# EAGLE design dawa_v2.1 (EAGLE 7.4.0)
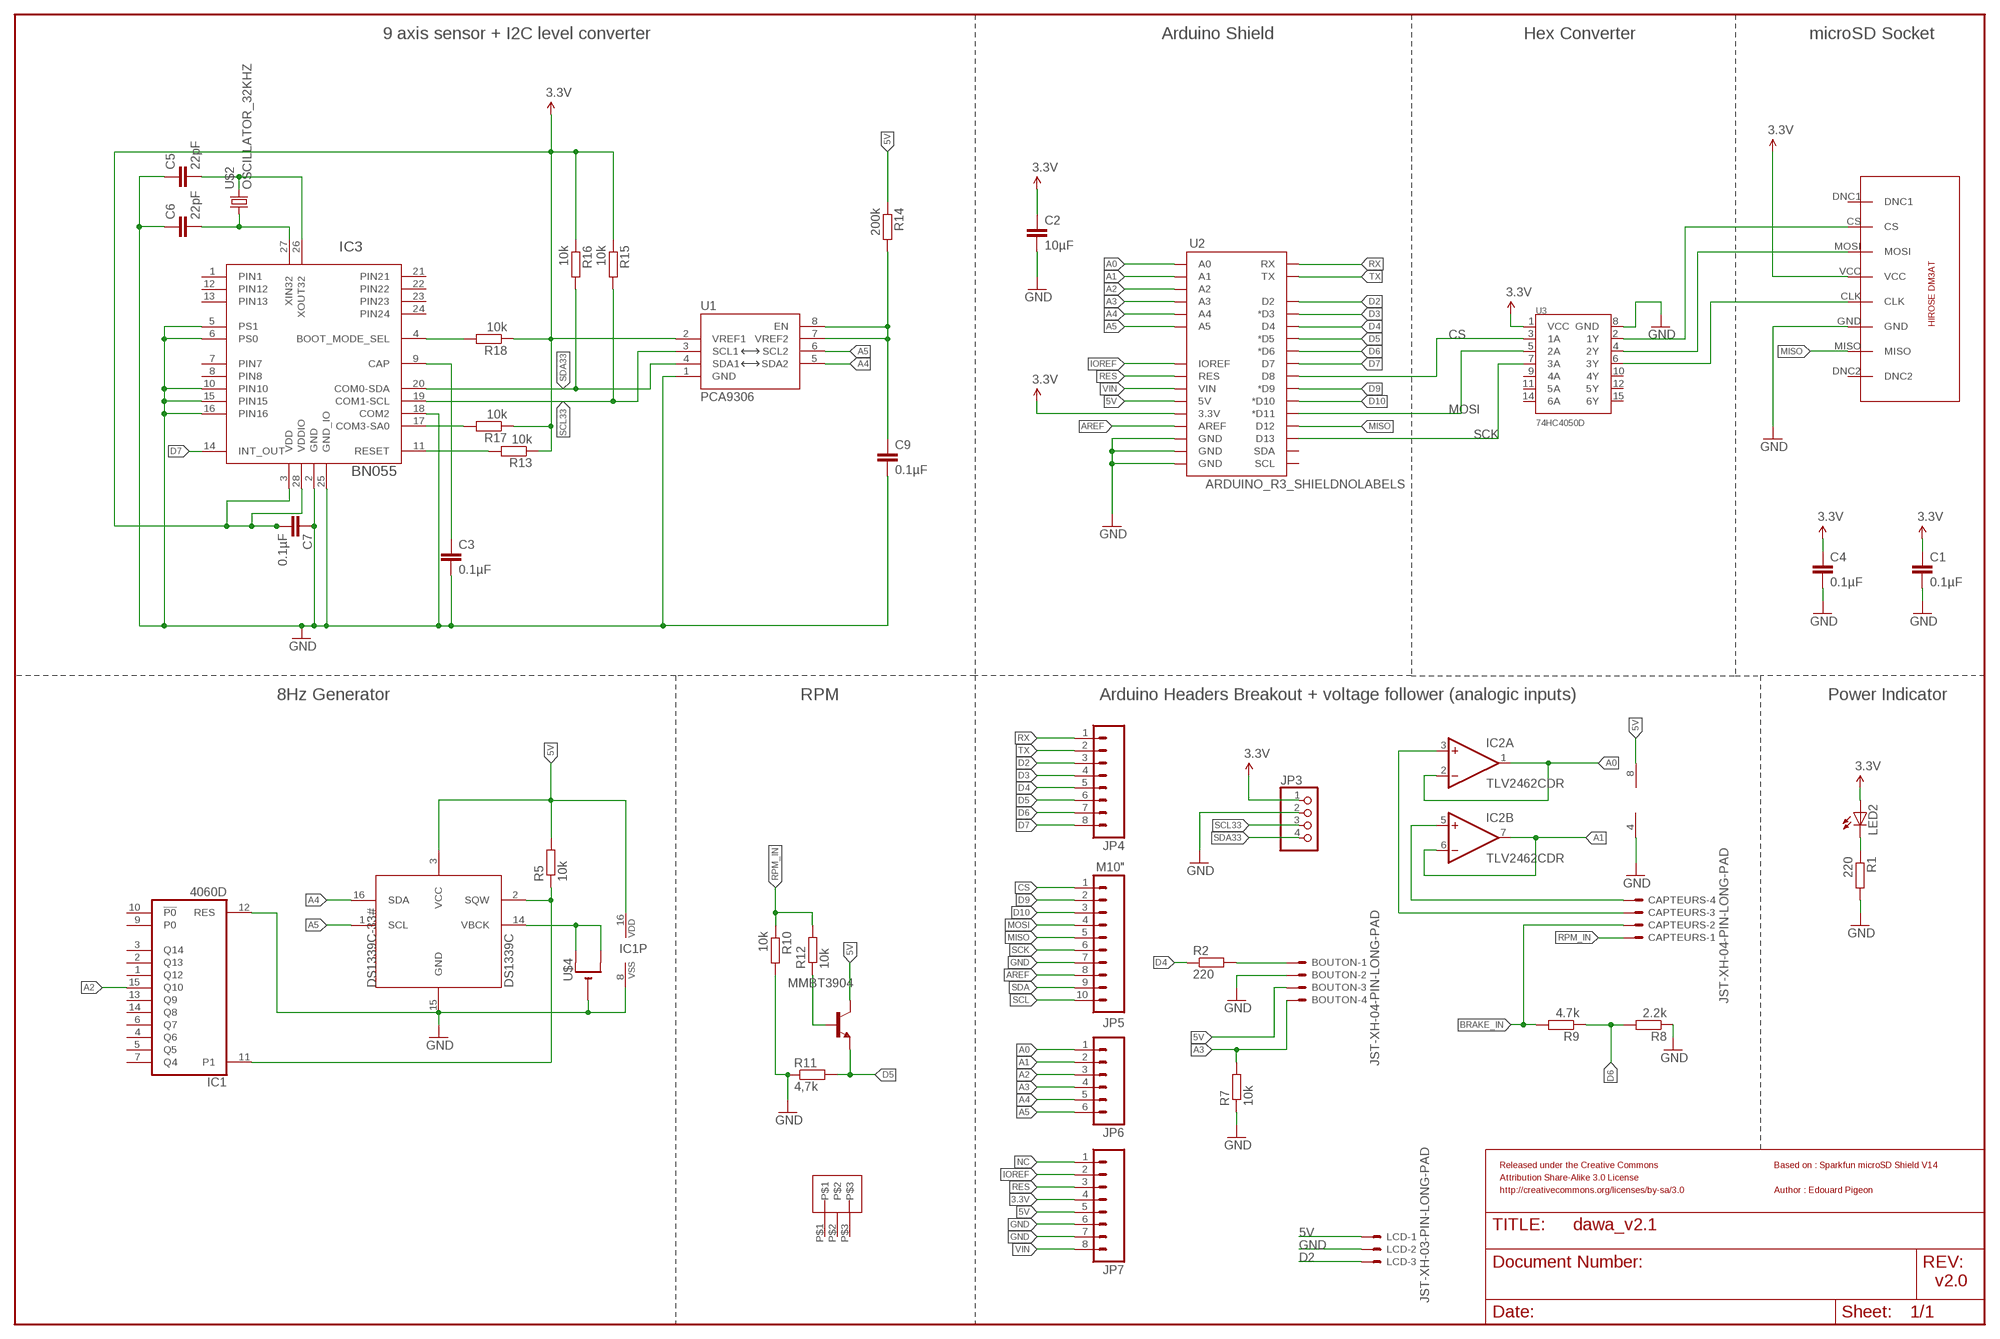
[diagram p0: schematic, sheet 1]

## Parts
BOUTON  JST-XH-04-PIN-LONG-PAD  [JST-XH-04-PACKAGE-LONG-PAD]
C1  0.1µF  C-EUC1206  [C1206]
C2  10µF  C-EUC1206  [C1206]
C3  0.1µF  C-EUC1206  [C1206]
C4  0.1µF  C-EUC1206  [C1206]
C5  22pF  C-EUC1206  [C1206]
C6  22pF  C-EUC1206  [C1206]
C7  0.1µF  C-EUC1206  [C1206]
C9  0.1µF  C-EUC1206  [C1206]
CAPTEURS  JST-XH-04-PIN-LONG-PAD  [JST-XH-04-PACKAGE-LONG-PAD]
DS1339C-33#  DS1339C  [DS1339C]
IC1  4060D  [SO16]
IC2  TLV2462CDR  LM358MX  [SO08]
IC3  BN055  1658_BNO055  [LGA-28_3.80X5.20/0.5]
JP3  PINHD-1X4  [1X04]
JP4  M08  [1X08]
JP5  M10"  [1X10]
JP6  M06SIP  [1X06]
JP7  M081X08  [1X08]
LCD  JST-XH-03-PIN-LONG-PAD  [JST-XH-03-PACKAGE-LONG-PAD]
LED2  LEDCHIPLED_1206  [CHIPLED_1206]
MMBT3904  MMBT3904LT1-NPN-SOT23-BEC  [SOT23-BEC]
R1  220  R-EU_M1206  [M1206]
R2  220  R-EU_M1206  [M1206]
R5  10k  R-EU_M1206  [M1206]
R7  10k  R-EU_M1206  [M1206]
R8  2.2k  R-EU_M1206  [M1206]
R9  4.7k  R-EU_M1206  [M1206]
R10  10k  R-EU_M1206  [M1206]
R11  4,7k  R-EU_M1206  [M1206]
R12  10k  R-EU_M1206  [M1206]
R13  10k  R-EU_M1206  [M1206]
R14  200k  R-EU_M1206  [M1206]
R15  10k  R-EU_M1206  [M1206]
R16  10k  R-EU_M1206  [M1206]
R17  10k  R-EU_M1206  [M1206]
R18  10k  R-EU_M1206  [M1206]
U1  PCA9306  [PSOP-8]
U2  ARDUINO_R3_SHIELDNOLABELS  [UNO_R3_SHIELD_NOLABELS]
U3  74HC4050D  HEX_CONVERTER  [SO016]
U$2  OSCILLATOR_32KHZ  [OSCILLATOR_SMD]
U$3  3_PIN_JST-XH  [3_PIN_JST-XH]
U$4  CR1220SMT  [CR1220-SMD]
U$5  DM3AT  [DM3AT]

## Nets
3.3V: C1.1 C2.1 C4.1 C7.2 IC3.3(VDD) IC3.28(VDDIO) JP3.1 JP7.4 LED2.A R13.1 R15.1 R16.1 R17.1 R18.1 U1.2(VREF1) U2.3.3V U3.1(VCC) U$5.VCC
5V: BOUTON.3 DS1339C-33#.3(VCC) IC1.16(VDD) IC2.8(P:V+) JP7.5 LCD.1 MMBT3904.C R5.2 R14.1 U2.5V
A0: IC2.1(A:OUT) IC2.2(A:-IN) JP6.1 U2.A0
A1: IC2.6(B:-IN) IC2.7(B:OUT) JP6.2 U2.A1
A2: IC1.15(Q10) JP6.3 U2.A2
A3: BOUTON.4 JP6.4 R7.2 U2.A3
A4: DS1339C-33#.16(SDA) JP6.5 U1.5(SDA2) U2.A4
A5: DS1339C-33#.1(SCL) JP6.6 U1.6(SCL2) U2.A5
AREF: JP5.8 U2.AREF
BRAKE_IN: CAPTEURS.2 R9.2
CS: JP5.1 U2.D8 U3.3(1A)
D2: JP4.3 LCD.3 U2.D2
D3: JP4.4 U2.D3(*D3)
D4: JP4.5 R2.1 U2.D4
D5: JP4.6 MMBT3904.E R11.2 U2.D5(*D5)
D6: JP4.7 R8.2 R9.1 U2.D6(*D6)
D7: IC3.14(INT_OUT) JP4.8 U2.D7
D9: JP5.2 U2.D9(*D9)
D10: JP5.3 U2.D10(*D10)
GND: BOUTON.2 C1.2 C2.2 C3.2 C4.2 C5.1 C6.1 C7.1 C9.2 DS1339C-33#.15(GND) IC1.8(VSS) IC1.12(RES) IC2.4(P:V-) IC3.2(GND) IC3.5(PS1) IC3.6(PS0) IC3.10(PIN10) IC3.15(PIN15) IC3.16(PIN16) IC3.18(COM2) IC3.25(GND_IO) JP3.2 JP5.7 JP7.6 JP7.7 LCD.2 R1.2 R7.1 R8.1 R10.2 R11.1 U1.1(GND) U2.GND@0(GND) U2.GND@1(GND) U2.GND@2(GND) U3.8(GND) U$4.- U$5.GND
IOREF: JP7.2 U2.IOREF
MISO: JP5.5 U2.D12 U$5.MISO
MOSI: JP5.4 U2.D11(*D11) U3.5(2A)
N$1: BOUTON.1 R2.2
N$2: U3.4(2Y) U$5.MOSI
N$3: DS1339C-33#.14(VBCK) U$4.+$1(+) U$4.+$2(+1)
N$4: U3.6(3Y) U$5.CLK
N$6: LED2.C R1.1
N$7: IC3.11(RESET) R13.2
N$9: CAPTEURS.4 IC2.5(B:+IN)
N$10: CAPTEURS.3 IC2.3(A:+IN)
N$12: C9.1 R14.2 U1.7(VREF2) U1.8(EN)
N$13: C3.1 IC3.9(CAP)
N$14: IC3.4(BOOT_MODE_SEL) R18.2
N$15: C5.2 IC3.26(XOUT32) U$2.2
N$16: C6.2 IC3.27(XIN32) U$2.1
N$17: IC3.17(COM3-SA0) R17.2
N$23: DS1339C-33#.2(SQW) IC1.11(P1) R5.1
N$45: MMBT3904.B R12.1
N$163: U3.2(1Y) U$5.CS
NC: JP7.1
RES: JP7.3 U2.RES
RPM_IN: CAPTEURS.1 R10.1 R12.2
RX: JP4.1 U2.RX
SCK: JP5.6 U2.D13 U3.7(3A)
SCL: JP5.10
SCL33: IC3.19(COM1-SCL) JP3.3 R15.2 U1.3(SCL1)
SDA: JP5.9
SDA33: IC3.20(COM0-SDA) JP3.4 R16.2 U1.4(SDA1)
TX: JP4.2 U2.TX
VIN: JP7.8 U2.VIN
Unconnected: IC1.1(Q12) IC1.2(Q13) IC1.3(Q14) IC1.4(Q6) IC1.5(Q5) IC1.6(Q7) IC1.7(Q4) IC1.9(P0) IC1.10(!P0) IC1.13(Q9) IC1.14(Q8) IC3.1(PIN1) IC3.7(PIN7) IC3.8(PIN8) IC3.12(PIN12) IC3.13(PIN13) IC3.21(PIN21) IC3.22(PIN22) IC3.23(PIN23) IC3.24(PIN24) U2.SCL U2.SDA U3.9(4A) U3.10(4Y) U3.11(5A) U3.12(5Y) U3.14(6A) U3.15(6Y) U$3.P$1 U$3.P$2 U$3.P$3 U$5.DNC1 U$5.DNC2

## Notes on the sheet
- 9 axis sensor + I2C level converter | Arduino Shield | Hex Converter | microSD Socket
- Power Indicator
- 8Hz Generator | RPM | Arduino Headers Breakout + voltage follower (analogic inputs)
- Released under the Creative Commons | Based on : Sparkfun microSD Shield V14
- Attribution Share-Alike 3.0 License
- http://creativecommons.org/licenses/by-sa/3.0 | Author : Edouard Pigeon
- v2.0

## Library data of the parts
BOUTON CAPTEURS = Rembrandt Electronics - JST XH Connectors v1-0:JST-XH-04-PIN: JST XH Connector 2 Pin Wire to board connector. Pitch: 2,54 mm, (0.100") Number of pins: 4 Created by Rembrandt Electronics www.rembrandtelectronics.com
C1-C7 C9 = rcl:C-EU: CAPACITOR, European symbol
DS1339C-33# = maxim-1339C:DS1339C: Real-Time Clock (RTC) Counts Seconds, Minutes, Hours, Day, Date, Month, and Year with Leap-Year Compensation Valid Up to 2100
IC1 = 40xx:4060: 14-stage binary/ripple COUNTER
IC2 = linear:LM358: OP AMP also LM158; LM258; LM2904 Source: http://cache.national.com/ds/LM/LM158.pdf
IC3 = BNO055:1658_BNO055: BN055 Intelligent 9-axis absolute orientation sensor; PART_NUMBER: BNO055
JP3 = pinhead:PINHD-1X4: PIN HEADER
JP4 = SparkFun:M08: Header 8 Standard 8-pin 0.1" header. Use with straight break away headers (SKU : PRT-00116), right angle break away headers (PRT-00553), swiss pins (PRT-00743), machine pins (PRT-00117), and female headers (PRT-00115).
JP5 = SparkFun-Connectors:M10: Header 10 Standard 10-pin 0.1" header. Use with straight break away headers (SKU : PRT-00116), right angle break away headers (PRT-00553), swiss pins (PRT-00743), machine pins (PRT-00117), and female headers (PRT-00115).
JP6 = SparkFun:M06: Header 6 Standard 6-pin 0.1" header. Use with straight break away headers (SKU : PRT-00116), right angle break away headers (PRT-00553), swiss pins (PRT-00743), machine pins (PRT-00117), and female headers (PRT-00115). Molex polarized connector foot print use with SKU : PRT-08094 with associated crimp pins and housings. NOTES ON THE VARIANTS LOCK and LOCK_LONGPADS... This footprint was designed to help hold the alignment of a through-hole component (i.e. 6-pin header) while soldering it into place. You may notice that each hole has been shifted either up or down by 0.005 of an inch from it's more standard position (which is a perfectly straight line). This slight alteration caused the pins (the squares in the middle) to touch the edges of the holes. Because they are alternating, it causes a "brace" to hold the component in place. 0.005 has proven to be the perfect amount of "off-center" position when using our standard breakaway headers. Although looks a little odd when you look at the bare footprint, once you have a header in there, the alteration is very hard to notice. Also, if you push a header all the way into place, it is covered up entirely on the bottom side. This idea of altering the position of holes to aid alignment will be further integrated into the Sparkfun Library for other footprints. It can help hold any component with 3 or more connection pins.
JP7 = SparkFun-Connectors:M08: Header 8 Standard 8-pin 0.1" header. Use with straight break away headers (SKU : PRT-00116), right angle break away headers (PRT-00553), swiss pins (PRT-00743), machine pins (PRT-00117), and female headers (PRT-00115).
LCD = Rembrandt Electronics - JST XH Connectors v1-0:JST-XH-03-PIN: JST XH Connector 2 Pin Wire to board connector. Pitch: 2,54 mm, (0.100") Number of pins: 3 Created by Rembrandt Electronics www.rembrandtelectronics.com
LED2 = led:LED: LED OSRAM: - CHIPLED LG R971, LG N971, LY N971, LG Q971, LY Q971, LO R971, LY R971 LH N974, LH R974 LS Q976, LO Q976, LY Q976 LO Q996 - Hyper CHIPLED LW Q18S LB Q993, LB Q99A, LB R99A - SideLED LS A670, LO A670, LY A670, LG A670, LP A670 LB A673, LV A673, LT A673, LW A673 LH A674 LY A675 LS A676, LA A676, LO A676, LY A676, LW A676 LS A679, LY A679, LG A679 - Hyper Micro SIDELED® LS Y876, LA Y876, LO Y876, LY Y876 LT Y87S - SmartLED LW L88C, LW L88S LB L89C, LB L89S, LG L890 LS L89K, LO L89K, LY L89K LS L896, LA L896, LO L896, LY L896 - TOPLED LS T670, LO T670, LY T670, LG T670, LP T670 LSG T670, LSP T670, LSY T670, LOP T670, LYG T670 LG T671, LOG T671, LSG T671 LB T673, LV T673, LT T673, LW T673 LH T674 LS T676, LA T676, LO T676, LY T676, LB T676, LH T676, LSB T676, LW T676 LB T67C, LV T67C, LT T67C, LS T67K, LO T67K, LY T67K, LW E67C LS E67B, LA E67B, LO E67B, LY E67B, LB E67C, LV E67C, LT E67C LW T67C LS T679, LY T679, LG T679 LS T770, LO T770, LY T770, LG T770, LP T770 LB T773, LV T773, LT T773, LW T773 LH T774 LS E675, LA E675, LY E675, LS T675 LS T776, LA T776, LO T776, LY T776, LB T776 LHGB T686 LT T68C, LB T68C - Hyper Mini TOPLED® LB M676 - Mini TOPLED Santana® LG M470 LS M47K, LO M47K, LY M47K Source: http://www.osram.convergy.de LUXEON: - LUMILED® LXK2-PW12-R00, LXK2-PW12-S00, LXK2-PW14-U00, LXK2-PW14-V00 LXK2-PM12-R00, LXK2-PM12-S00, LXK2-PM14-U00 LXK2-PE12-Q00, LXK2-PE12-R00, LXK2-PE12-S00, LXK2-PE14-T00, LXK2-PE14-U00 LXK2-PB12-K00, LXK2-PB12-L00, LXK2-PB12-M00, LXK2-PB14-N00, LXK2-PB14-P00, LXK2-PB14-Q00 LXK2-PR12-L00, LXK2-PR12-M00, LXK2-PR14-Q00, LXK2-PR14-R00 LXK2-PD12-Q00, LXK2-PD12-R00, LXK2-PD12-S00 LXK2-PH12-R00, LXK2-PH12-S00 LXK2-PL12-P00, LXK2-PL12-Q00, LXK2-PL12-R00 Source: www.luxeon.com KINGBRIGHT: KA-3528ASYC Source: www.kingbright.com
MMBT3904 = transistor:*-NPN-: NPN Transistror BF959 corrected 2008.03.06
R1 R2 R7-R9 = resistor:R-EU_: RESISTOR, European symbol
R5 R10-R18 = rcl:R-EU_: RESISTOR, European symbol
U1 = SparkFun-DigitalIC:PCA9306: Bidirectional I2C level shifter. NOT compatible with all available part number pinout schemes- DOUBLE CHECK!!!; PROD_ID: IC-10023
U2 = SparkFun-Boards:ARDUINO_R3_SHIELD: Shield form compatible with the Arduino Uno R3.
U3 = SparkFun:HEX_CONVERTER
U$2 = kanflo:OSCILLATOR_32KHZ: CM7V-T1A Tuning Fork Crystal 32.768 kHz
U$3 = JST-XH_HEADERS:3_PIN_JST-XH
U$4 = adafruit:CR1220: CR1216/CR1220/CR1225 12mm 3V lithium coin cell Great for battery packup. Both SMT and THM holders. Note the THM package has the ground pads on both sides of the PCB so that the masks are the same - this reduces the cost
U$5 = HIROSE-DM3AT(1):DM3AT

## Board
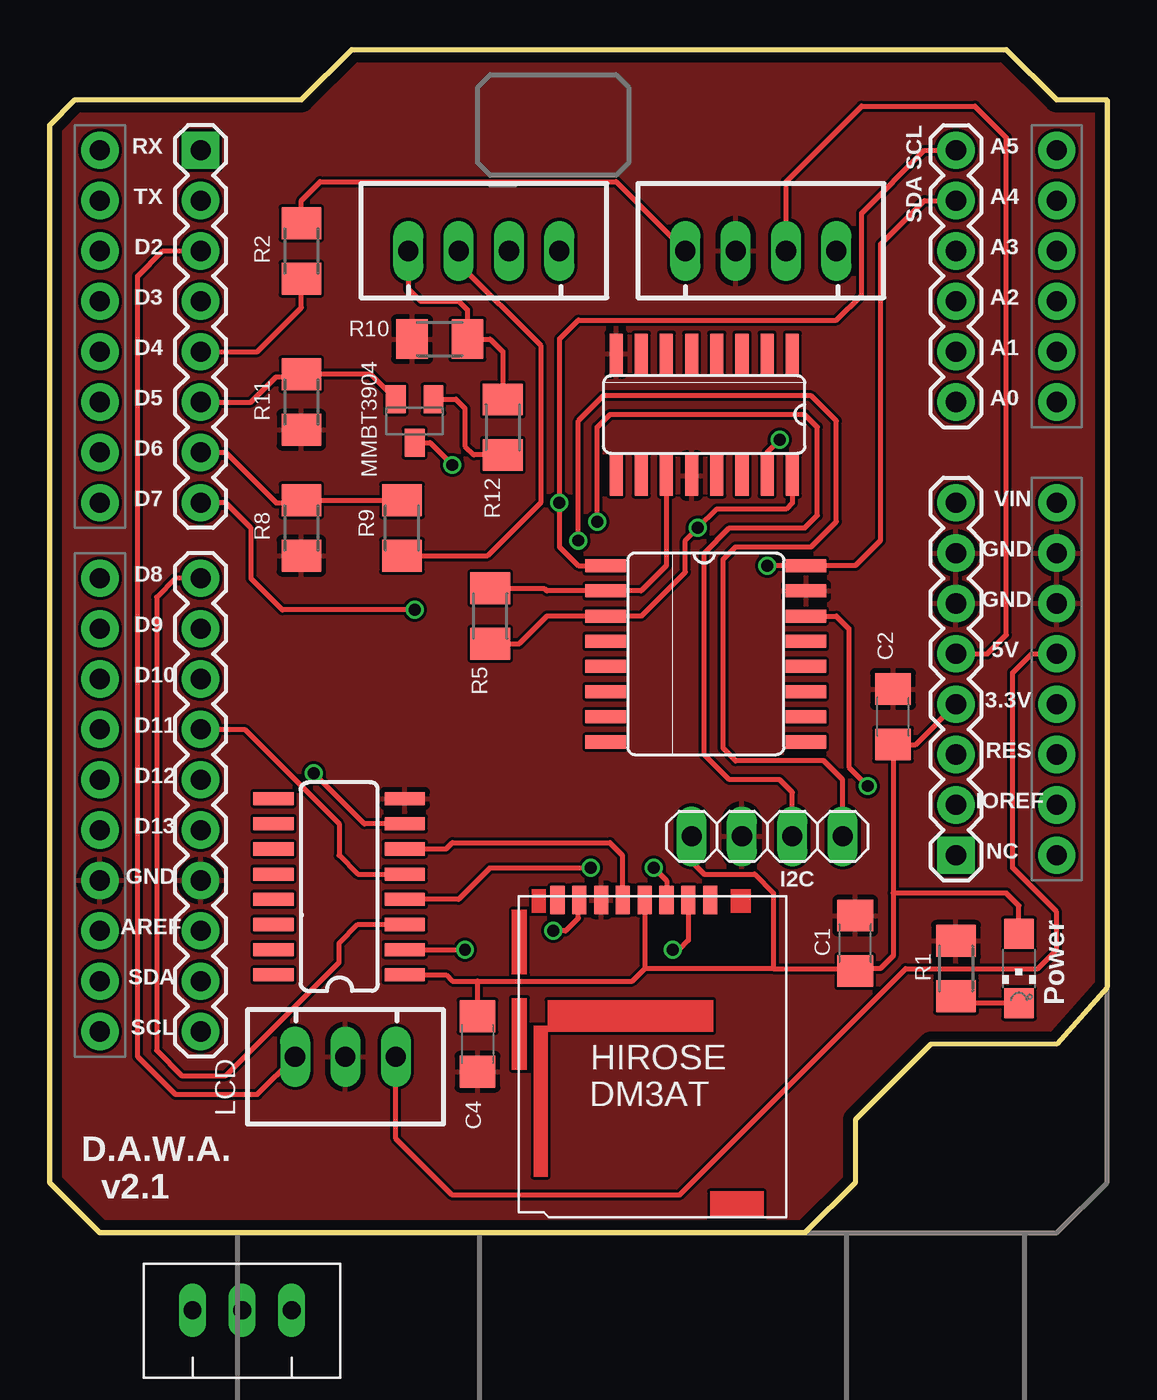
[diagram p1: board, top side]
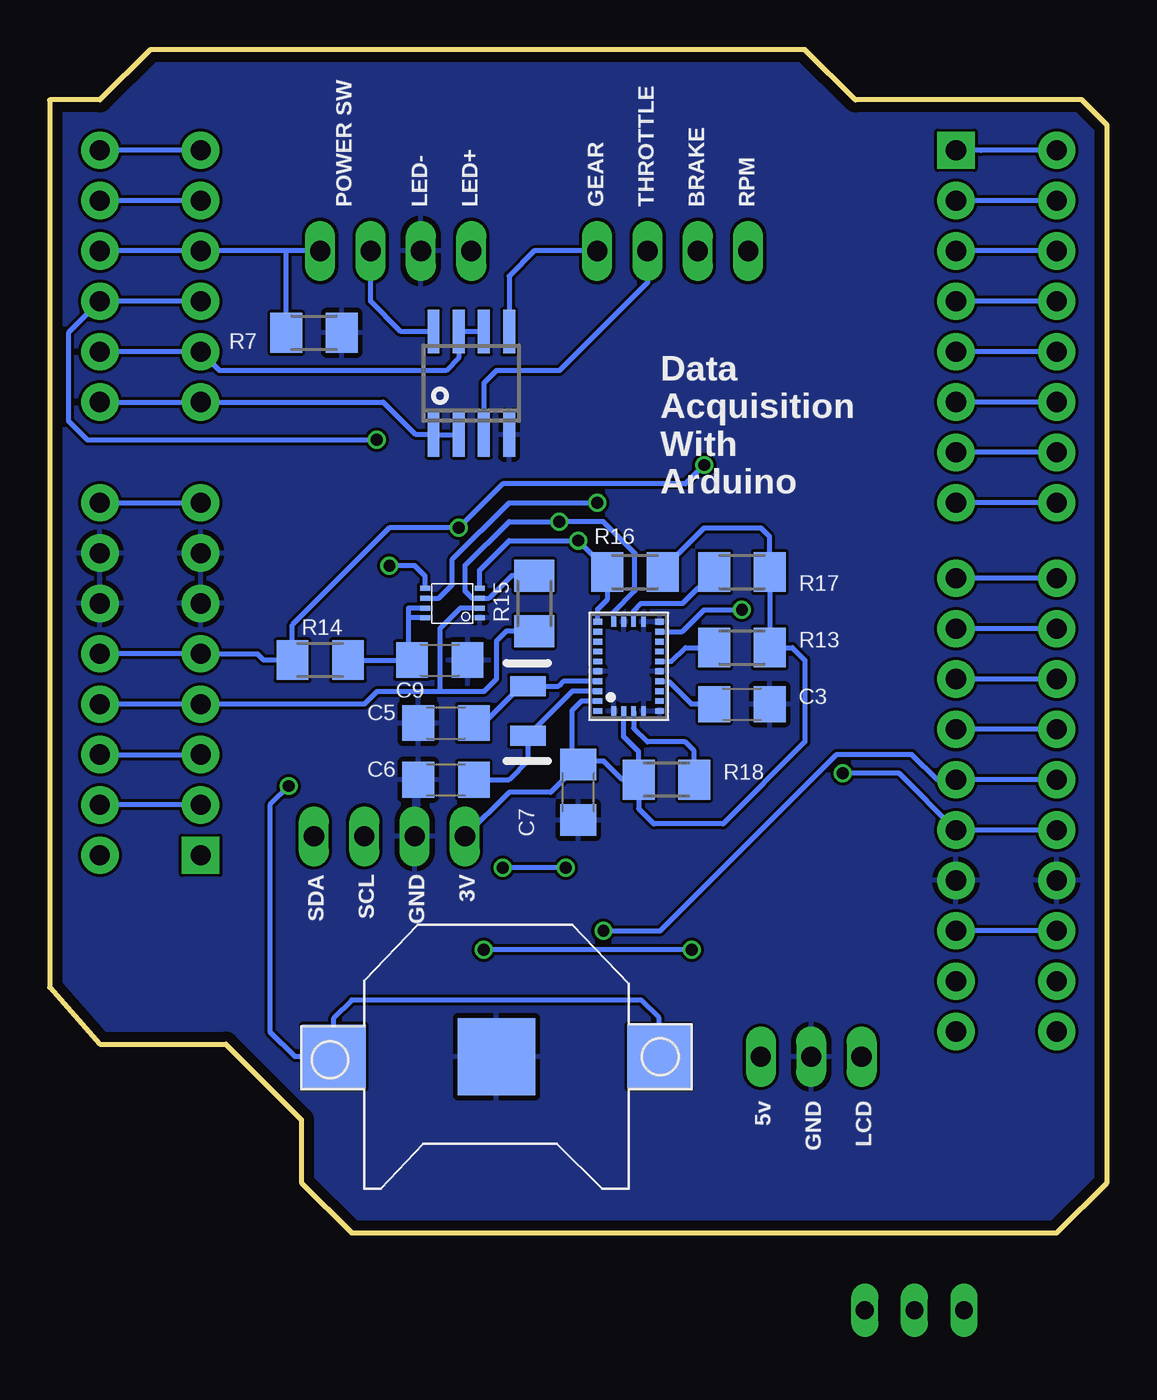
[diagram p2: board, bottom side, seen from below]

Size 53.34 x 59.69 mm. Coordinates in mm from the lower left corner, seen from the top.
Outline: 0,2.54 0,55.88 1.27,57.15 12.7,57.15 15.24,59.69 48.26,59.69 50.8,57.15 53.34,57.15 53.34,12.38 50.8,9.53 44.45,9.53 40.64,5.71 40.64,2.54 38.1,0 2.54,0 0,2.54
Copper layers (1*16): Top 0.035mm / dielectric 1.6mm / Bottom 0.035mm
Design rules "Elecrow_2-layer_PCB_eagle_rule": minimum track width 6mil, minimum drill 12mil, track to track 6mil, track to pad 6mil, pad to pad 6mil, via to via 8mil, smd to smd 0mil, copper to edge 20mil, drill to drill 10mil, minimum pad ring 6mil, minimum via ring 6mil, stop-mask expansion 0mil, vias tented up to drill 100mil, thermal gap 10mil

### Footprints (pad centres in the part's own frame; a part is rotated, then mirrored left to right if it is on the bottom)
JST-XH-04-PACKAGE-LONG-PAD = drill 1.016 long: 1 -3.81,0; 2 -1.27,0; 3 1.27,0; 4 3.81,0
C1206 = smd 1.6 x 1.8: 1 -1.4,0; 2 1.4,0
DS1339C = smd 0.66 x 2.032: 1 -4.445,-4.978; 2 -3.175,-4.978; 3 -1.905,-4.978; 4 -0.635,-4.978; 5 0.635,-4.978; 6 1.905,-4.978; 7 3.175,-4.978; 8 4.445,-4.978; 9 4.445,5.137; 10 3.175,5.137; 11 1.905,5.137; 12 0.635,5.137; 13 -0.635,5.137; 14 -1.905,5.137; 15 -3.175,5.137; 16 -4.445,5.137
SO16 = smd 0.66 x 2.032: 1 -4.445,-3.073; 2 -3.175,-3.073; 3 -1.905,-3.073; 4 -0.635,-3.073; 5 0.635,-3.073; 6 1.905,-3.073; 7 3.175,-3.073; 8 4.445,-3.073; 9 4.445,3.073; 10 3.175,3.073; 11 1.905,3.073; 12 0.635,3.073; 13 -0.635,3.073; 14 -1.905,3.073; 15 -3.175,3.073; 16 -4.445,3.073
SO08 = smd 0.6 x 2.2: 1 -1.905,-2.6; 2 -0.635,-2.6; 3 0.635,-2.6; 4 1.905,-2.6; 5 1.905,2.6; 6 0.635,2.6; 7 -0.635,2.6; 8 -1.905,2.6
LGA-28_3.80X5.20/0.5 = smd 0.3 x 0.5: 1 -2.25,1.56; 6 -2.25,-1.56; 7 -1.75,-1.56; 8 -1.25,-1.56; 9 -0.75,-1.56; 10 -0.25,-1.56; 11 0.25,-1.56; 12 0.75,-1.56; 13 1.25,-1.56; 14 1.75,-1.56; 15 2.25,-1.56; 20 2.25,1.56; 21 1.75,1.56; 22 1.25,1.56; 23 0.75,1.56; 24 0.25,1.56; 25 -0.25,1.56; 26 -0.75,1.56; 27 -1.25,1.56; 28 -1.75,1.56 | smd 0.5 x 0.3: 2 -2.25,0.75; 3 -2.25,0.25; 4 -2.25,-0.25; 5 -2.25,-0.75; 16 2.25,-0.75; 17 2.25,-0.25; 18 2.25,0.25; 19 2.25,0.75
1X04 = drill 1.016 long: 1 -3.81,0; 2 -1.27,0; 3 1.27,0; 4 3.81,0
1X08 = drill 1.016 pad 1.88 square: 1 0,0 | drill 1.016 pad 1.88: 2 2.54,0; 3 5.08,0; 4 7.62,0; 5 10.16,0; 6 12.7,0; 7 15.24,0; 8 17.78,0
1X10 = drill 1.016 pad 1.88: 1 0,0; 2 2.54,0; 3 5.08,0; 4 7.62,0; 5 10.16,0; 6 12.7,0; 7 15.24,0; 8 17.78,0; 9 20.32,0; 10 22.86,0
1X06 = drill 1.016 pad 1.88: 1 0,0; 2 2.54,0; 3 5.08,0; 4 7.62,0; 5 10.16,0; 6 12.7,0
JST-XH-03-PACKAGE-LONG-PAD = drill 1.016 long: 1 -2.54,0; 2 0,0; 3 2.54,0
CHIPLED_1206 = smd 1.5 x 1.5: A 0,-1.75; C 0,1.75
SOT23-BEC = smd 1 x 1.4: B -0.95,-1.1; C 0,1.1; E 0.95,-1.1
M1206 = smd 1.6 x 2: 1 -1.4,0; 2 1.4,0
PSOP-8 = smd 0.25 x 0.5: 1 -0.73,-1.37; 2 -0.23,-1.37; 3 0.27,-1.37; 4 0.77,-1.37; 5 0.77,1.38; 6 0.27,1.38; 7 -0.23,1.38; 8 -0.73,1.38
UNO_R3_SHIELD_NOLABELS = drill 1.016 pad 1.88: 3.3V 50.8,26.67; 5V 50.8,29.21; A0 50.8,41.91; A1 50.8,44.45; A2 50.8,46.99; A3 50.8,49.53; A4 50.8,52.07; A5 50.8,54.61; AREF 2.54,15.24; D2 2.54,49.53; D3 2.54,46.99; D4 2.54,44.45; D5 2.54,41.91; D6 2.54,39.37; D7 2.54,36.83; D8 2.54,33.02; D9 2.54,30.48; D10 2.54,27.94; D11 2.54,25.4; D12 2.54,22.86; D13 2.54,20.32; GND@0 50.8,31.75; GND@1 50.8,34.29; GND@2 2.54,17.78; IOREF 50.8,21.59; NC 50.8,19.05; RES 50.8,24.13; RX 2.54,54.61; SCL 2.54,10.16; SDA 2.54,12.7; TX 2.54,52.07; VIN 50.8,36.83
SO016 = smd 0.66 x 2.032: 1 -4.445,-3.315; 2 -3.175,-3.315; 3 -1.905,-3.315; 4 -0.635,-3.315; 5 0.635,-3.315; 6 1.905,-3.315; 7 3.175,-3.315; 8 4.445,-3.315; 9 4.445,3.315; 10 3.175,3.315; 11 1.905,3.315; 12 0.635,3.315; 13 -0.635,3.315; 14 -1.905,3.315; 15 -3.175,3.315; 16 -4.445,3.315
OSCILLATOR_SMD = smd 1 x 1.8: 1 0,0; 2 2.5,0
3_PIN_JST-XH = drill 0.9 long: P$1 2.45,3.4; P$2 4.95,3.4; P$3 7.45,3.4
CR1220-SMD = smd 3.2 x 3.2: +$1 -8.2,0; +$2 8.2,0 | smd 3.9 x 3.9: - 0,0
DM3AT = smd 0.711 x 1.422: CLK -1.56,6.63; CS 1.74,6.63; DNC1 2.84,6.63; DNC2 -4.86,6.63; GND -2.66,6.63; MISO -3.76,6.63; MOSI 0.64,6.63; VCC -0.46,6.63

### Placement (x,y rotation side)
BOUTON  35.88,49.53 0 top
C1  40.64,14.61 90 top
C2  42.55,26.04 90 top
C3  18.41,26.67 0 bottom
C4  21.59,9.53 270 top
C5  33.34,25.72 0 bottom
C6  33.34,22.86 0 bottom
C7  26.67,22.23 90 bottom
C9  33.66,28.89 0 bottom
CAPTEURS  21.91,49.53 0 top
DS1339C-33#  33.02,29.21 270 top
IC1  33.02,41.27 180 top
IC2  32.07,42.86 0 bottom
IC3  24.13,28.57 90 bottom
JP3  36.2,20 0 top
JP4  7.62,54.61 270 top
JP5  7.62,33.02 270 top
JP6  45.72,41.91 90 top
JP7  45.72,19.05 90 top
LCD  14.92,8.89 180 top
LED2  48.9,13.34 180 top
MMBT3904  18.41,40.96 180 top
R1  45.72,13.34 90 top
R2  12.7,49.53 90 top
R5  22.22,31.11 270 top
R7  40.01,45.4 180 bottom
R8  12.7,35.56 90 top
R9  17.78,35.56 270 top
R10  19.68,45.09 180 top
R11  12.7,41.91 90 top
R12  22.86,40.64 90 top
R13  18.41,29.53 180 bottom
R14  39.69,28.89 0 bottom
R15  28.89,31.75 90 bottom
R16  23.81,33.34 180 bottom
R17  18.41,33.34 180 bottom
R18  22.22,22.86 0 bottom
U1  33.02,31.75 90 bottom
U2  0,0 0 top
U3  14.61,17.46 90 top
U$2  29.21,25.08 90 bottom
U$3  4.76,-7.3 0 top  (outside the outline)
U$4  30.8,8.89 180 bottom
U$5  30.48,10.16 0 top

### Tracks (layer width: path | path; a pad name or v marks a point on that pad's centre or on a via)
3.3V
  Top 0.254: LED2.A 48.9,16.51 48.26,17.14 42.55,17.14 | JP7.4 43.69,24.64 C2.1 42.55,17.14 | 42.55,17.14 42.55,13.97 41.91,13.34 40.77,13.34 C1.1 40.51,13.34 36.51,13.34 | JP3.1 32.38,18.73 33.02,18.1 35.56,18.1 36.51,17.14 36.51,13.34 | 36.51,13.34 30.02,13.34 | U$5.VCC 30.02,13.34 | U3.1 20,13.02 20.32,12.7 21.59,12.7 | 21.59,12.7 29.38,12.7 30.02,13.34 | C4.1 21.59,12.7
  Bottom 0.254: 26.99,24.13 26.67,23.81 C7.2 28.07,22.23 30.16,22.23 JP3.1 | 26.99,24.13 26.99,26.35 26.52,26.82 IC3.28 | R15.1 30.29,30.35 30.8,29.84 30.8,27.94 31.43,27.3 33.66,27.3 | R16.1 22.41,33.47 20.32,35.56 17.46,35.56 17.02,35.11 R17.1 R13.1 15.88,29.53 15.24,28.89 15.24,24.77 19.37,20.64 22.86,20.64 23.62,21.4 R18.1 | 33.66,27.3 36.83,27.3 37.47,26.67 JP7.4 U2.3.3V | U1.2 32.62,31.52 33.66,30.48 33.66,27.3 | R18.1 23.62,24.26 24.38,25.02 IC3.3 | 26.99,24.13 26.99,23.81 25.4,23.81 24.45,22.86 R18.1
5V  (via drill 0.6 pad 0.25)
  Top 0.254: JP7.5 47.31,29.21 48.26,30.16 48.26,55.24 46.67,56.83 40.96,56.83 37.15,53.02 BOUTON.3 | v20.32,38.73 19.2,39.86 MMBT3904.C | IC1.16 37.47,36.83 37.15,36.51 33.66,36.51 v32.7,35.56 32.07,34.92 32.07,33.34 29.84,31.11 DS1339C-33#.3 25.08,31.11 23.68,29.71 R5.2 | U2.5V 49.53,29.21 48.58,28.26 48.58,18.41 50.8,16.19 50.8,14.29 49.85,13.34 43.18,13.34 31.75,1.91 20.32,1.91 17.46,4.76 LCD.1
  Bottom 0.254: U2.5V JP7.5 42.86,29.21 42.55,28.89 R14.1 41.09,30.67 36.2,35.56 v32.7,35.56 30.48,37.78 21.27,37.78 v20.32,38.73 | IC2.8 35.62,45.46 37.15,46.99 BOUTON.3
A0
  Bottom 0.254: IC2.2 IC2.1 34.87,40.26 36.51,41.91 JP6.1 U2.A0
A1
  Bottom 0.254: U2.A1 JP6.2 44.77,43.5 33.34,43.5 32.7,44.13 IC2.7 IC2.6
A2  (via drill 0.6 pad 0.25)
  Top 0.254: IC1.15 36.2,39.37 v36.83,40.01
  Bottom 0.254: JP6.3 U2.A2 52.39,45.4 52.39,40.96 51.44,40.01 v36.83,40.01
A3
  Bottom 0.254: U2.A3 JP6.4 41.41,49.53 | BOUTON.4 41.41,49.53 | R7.2 41.41,49.53
A4  (via drill 0.6)
  Top 0.254: JP6.5 44.13,52.07 41.91,49.85 41.91,34.92 40.64,33.66 DS1339C-33#.16 v36.2,33.66
  Bottom 0.254: JP6.5 U2.A4 | U1.5 34.4,33.13 34.93,33.66 v36.2,33.66
A5  (via drill 0.6)
  Top 0.254: JP6.6 44.13,54.61 40.96,51.44 40.96,47.31 39.69,46.04 26.67,46.04 25.72,45.09 v25.72,36.83 25.72,34.61 26.67,33.66 DS1339C-33#.1
  Bottom 0.254: JP6.6 U2.A5 | U1.6 33.7,32.02 33.02,32.7 33.02,33.97 30.16,36.83 v25.72,36.83
AREF
  Bottom 0.254: U2.AREF JP5.8
BRAKE_IN
  Top 0.254: R9.2 22.09,34.16 24.77,36.83 24.77,44.77 20.64,48.9 CAPTEURS.2
CS
  Top 0.254: JP5.1 6.35,33.02 5.4,32.07 5.4,9.21 6.67,7.94 8.89,7.94 14.61,13.65 14.61,14.61 15.56,15.56 U3.3
  Bottom 0.254: U2.D8 JP5.1
D2
  Top 0.254: JP4.3 5.71,49.53 4.45,48.26 4.45,8.89 6.35,6.99 10.48,6.99 LCD.3
  Bottom 0.254: U2.D2 JP4.3
D3
  Bottom 0.254: U2.D3 JP4.4
D4
  Top 0.254: JP4.5 10.48,44.45 12.7,46.67 R2.1
  Bottom 0.254: U2.D4 JP4.5
D5
  Top 0.254: JP4.6 10.16,41.91 11.43,43.18 12.7,43.18 R11.2 | 13,43.01 R11.2 | MMBT3904.E 16.21,43.31 R11.2
  Bottom 0.254: U2.D5 JP4.6
D6
  Top 0.254: JP4.7 8.89,39.37 11.43,36.83 12.57,36.83 R8.2 R9.1
  Bottom 0.254: U2.D6 JP4.7
D7  (via drill 0.6)
  Top 0.254: v18.41,31.43 11.75,31.43 10.16,33.02 10.16,35.56 8.89,36.83 JP4.8
  Bottom 0.254: U2.D7 JP4.8 | IC3.14 21.43,30.32 20.32,31.43 v18.41,31.43
D9
  Bottom 0.254: U2.D9 JP5.2
D10
  Bottom 0.254: U2.D10 JP5.3
GND
  pour Bottom: 2.54,0 0,2.54 0,55.88 1.27,57.15 12.7,57.15 15.24,59.69 48.26,59.69 50.8,57.15 53.34,57.15 53.34,12.38 50.8,9.53 44.45,9.53 40.64,5.71 40.64,2.54 38.1,0
  pour Top: 2.54,0 0,2.54 0,55.88 1.27,57.15 12.7,57.15 15.24,59.69 48.26,59.69 50.8,57.15 53.34,57.15 53.34,12.38 50.8,9.53 44.45,9.53 40.64,5.71 40.64,2.54 38.1,0
IOREF
  Bottom 0.254: JP7.2 U2.IOREF
MISO  (via drill 0.6)
  Top 0.254: v25.4,15.24 26.04,15.24 26.67,15.88 26.67,16.74 U$5.MISO
  Bottom 0.254: U2.D12 JP5.5 8.57,22.86 9.84,24.13 13.65,24.13 22.54,15.24 v25.4,15.24
MOSI
  Top 0.254: JP5.4 9.84,25.4 14.61,20.64 14.61,19.05 15.56,18.1 U3.5
  Bottom 0.254: U2.D11 JP5.4
N$1
  Top 0.254: R2.2 12.7,52.07 13.65,53.02 28.57,53.02 BOUTON.1
N$2  (via drill 0.6 pad 0.25)
  Top 0.254: v27.3,18.41 22.22,18.41 20.64,16.83 U3.4 | v30.48,18.41 31.12,17.77 U$5.MOSI
  Bottom 0.254: v27.3,18.41 v30.48,18.41
N$3  (via drill 0.6)
  Top 0.254: DS1339C-33#.14 39.69,31.11 40.32,30.48 40.32,23.5 v41.28,22.54
  Bottom 0.254: v41.28,22.54 42.23,21.59 42.23,10.16 40.96,8.89 U$4.+$2 39,10.85 38.1,11.75 23.5,11.75 22.6,10.85 U$4.+$1
N$4
  Top 0.254: U3.6 20,19.37 20.32,19.68 28.26,19.68 28.89,19.05 28.89,16.82 U$5.CLK
N$6
  Top 0.254: LED2.C 45.44,11.59 R1.1
N$7
  Bottom 0.254: IC3.11 21.97,28.82 21.27,29.53 R13.2
N$9
  Bottom 0.254: CAPTEURS.4 28.89,49.53 30.16,48.26 IC2.5
N$10
  Bottom 0.254: IC2.3 31.43,42.86 30.8,43.5 27.62,43.5 23.18,47.94 CAPTEURS.3
N$12
  Bottom 0.254: 35.24,31.02 35.24,31.52 U1.7 | 35.24,31.02 35.24,29.71 C9.1 R14.2 | U1.8 35.24,31.02
N$13
  Bottom 0.254: IC3.9 22.11,27.82 20.95,26.67 C3.1
N$14
  Bottom 0.254: IC3.4 23.88,25.47 23.18,24.77 21.27,24.77 20.82,24.32 R18.2
N$15
  Bottom 0.254: IC3.26 27.42,27.82 27.66,27.58 U$2.2 29.57,27.58 31.43,25.72 C5.2
N$16
  Bottom 0.254: IC3.27 26.97,27.32 U$2.1 29.21,23.81 30.16,22.86 C6.2
N$17
  Bottom 0.254: IC3.17 23.88,31.36 23.5,31.75 21.4,31.75 R17.2
N$23
  Top 0.254: IC1.11 31.11,33.66 29.84,32.38 DS1339C-33#.2 25.08,32.38 24.95,32.52 R5.1
N$45
  Top 0.254: MMBT3904.B 20.49,42.06 20.95,41.59 20.95,39.69 21.4,39.24 R12.1
N$163  (via drill 0.6)
  Top 0.254: U3.2 v20.95,14.29 | v31.43,14.29 31.75,14.29 32.22,14.76 U$5.CS
  Bottom 0.254: v20.95,14.29 v31.43,14.29
RES
  Bottom 0.254: U2.RES JP7.3
RPM_IN
  Top 0.254: CAPTEURS.1 18.1,47.62 18.73,46.99 20.64,46.99 21.09,46.54 R10.1 22.22,45.09 22.86,44.45 R12.2
RX
  Bottom 0.254: U2.RX 6.35,54.61 JP4.1
SCK  (via drill 0.6 pad 0.25)
  Top 0.254: U3.7 15.88,20.64 v13.33,23.18
  Bottom 0.254: U2.D13 JP5.6 10.48,23.18 v13.33,23.18
SCL33  (via drill 0.6)
  Top 0.254: JP3.3 37.47,22.23 36.83,22.86 34.29,22.86 33.02,24.13 33.02,34.29 34.29,35.56 38.1,35.56 38.74,36.2 38.74,40.64 38.1,41.27 28.26,41.27 27.62,40.64 v27.62,35.88
  Bottom 0.254: IC3.19 24.88,31.32 23.81,32.38 23.81,34.29 25.4,35.88 v27.62,35.88 30.16,35.88 32.38,33.66 32.38,32.38 32.02,32.02 U1.3 31.16,32.02 30.03,33.15 R15.2
SDA33  (via drill 0.6)
  Top 0.254: JP3.4 40.01,22.86 39.05,23.81 34.61,23.81 33.97,24.45 33.97,33.97 34.61,34.61 38.42,34.61 39.69,35.88 39.69,40.96 38.42,42.23 27.94,42.23 26.67,40.96 v26.67,34.92
  Bottom 0.254: U1.4 31.65,33.44 30.16,34.92 v26.67,34.92 25.21,33.47 R16.2 25.21,31.94 25.69,31.46 IC3.20
TX
  Bottom 0.254: U2.TX JP4.2
VIN
  Bottom 0.254: U2.VIN JP7.8

### Text on the board
tPlace: SCL | RX | A5 | TX | SDA | A4 | D2 | A3 | D3 | A2 | D4 | A1 | D5 | A0 | D6 | D7 | VIN | GND | D8 | GND | D9 | 5V | D10 | 3.3V | D11 | RES | D12 | IOREF | D13 | NC | GND | I2C | AREF | SDA | SCL | Power | D.A.W.A. / v2.1
bPlace: RPM | BRAKE | THROTTLE | GEAR | LED+ | LED- | POWER SW | Data / Acquisition / With / Arduino | 3V | GND | SCL | SDA | LCD | GND | 5v